# EAGLE schematic Golf Cart Schematic (EAGLE 7.7.0)
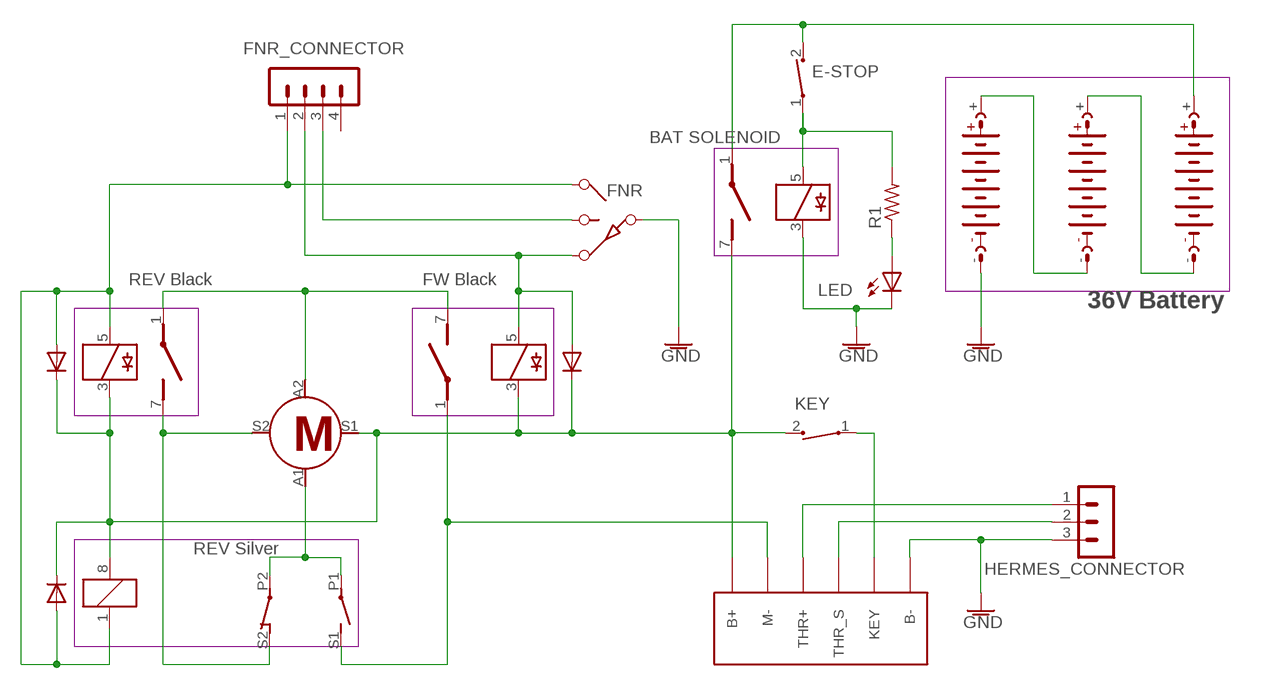
[diagram p0: schematic, sheet 1]

## Parts
D1  1N4933  [DO41-10]
D2  1N4933  [DO41-10]
D3  1N4933  [DO41-10]
E-STOP  CT10-XXXX-G1  [CT10-XXXX-G1]
FNR_CONNECTOR  MA04-1  [MA04-1]
G1  AB9V  [AB9V]
G2  AB9V  [AB9V]
G3  AB9V  [AB9V]
HERMES_CONNECTOR  MA03-1  [MA03-1]
K1  BAT SOLENOID  35701331  [REED]
K2  REV Silver  G6C-2117P  [G6C-2117P]
K4  REV Black  35701331  [REED]
K5  FW Black  35701331  [REED]
KEY  CT10-XXXX-G1  [CT10-XXXX-G1]
LED  LED_E  [LED_1206]
R1  R-US_0204/7  [0204/7]
U$1  MOTOR_PH  [MOTOR_PH]
U$2  THROTTLE_CTRL  [THROTTLE_CTRL]
U$3  FNR  [FNR]

## Nets
GNDA: G2.- HERMES_CONNECTOR.3 K1.3 LED.C U$2.P$2(B-) U$3.P$4(C) ; supply symbol labelled GND
N$1: K4.1(2:P) K5.7(2:S) U$1.A2
N$2: K2.P1(2:P) K2.P2(3:P) U$1.A1
N$3: K2.S2(3:O) K4.7(2:S) U$1.S2
N$4: K2.S1(2:S) K5.1(2:P) U$2.P$4(M-)
N$5: D1.C D2.C D3.C K1.7(2:S) K2.8 K4.3 K5.3 KEY.2 U$1.S1 U$2.P$1(B+)
N$6: D1.A D2.A FNR_CONNECTOR.1 K2.1 K4.5 U$3.P$1
N$8: G1.+ G3.-
N$9: D3.A FNR_CONNECTOR.2 K5.5 U$3.P$3
N$11: E-STOP.2 G3.+ K1.1(2:P)
N$12: E-STOP.1 K1.5 R1.2
N$13: LED.A R1.1
N$14: KEY.1 U$2.P$3(KEY)
N$15: HERMES_CONNECTOR.1 U$2.P$5(THR+)
N$16: HERMES_CONNECTOR.2 U$2.P$6(THR_S)
N$18: G1.- G2.+
N$19: FNR_CONNECTOR.3 U$3.P$2
Unconnected: FNR_CONNECTOR.4

## Notes on the sheet
- 36V Battery

## Library data of the parts
D1-D3 = diode:1N4933: DIODE fast recovery rectifier, 1A
E-STOP KEY = switch-coto:CT10-XXXX-: CT10 Series Molded Switch Source: www.cotorelay.com .. Coto_Technology__CT10-1530-G1.pdf
FNR_CONNECTOR = con-lstb:MA04-1: PIN HEADER; OC_FARNELL: unknown; OC_NEWARK: unknown
G1-G3 = battery:AB9V: 9-V BATTERY CLIP
HERMES_CONNECTOR = con-lstb:MA03-1: PIN HEADER; OC_FARNELL: unknown; OC_NEWARK: unknown
K1 K4 K5 = relay:35701331: RELAY reed, 1 x norm. open with polarity; OC_FARNELL: unknown; OC_NEWARK: unknown
K2 = relay:G6C-2117P: RELAY 1 x norm. open, 1x norm. closed, 10 A/240 V, Omron; OC_FARNELL: unknown; OC_NEWARK: unknown
LED = eagle-ltspice:LED_E: LED Source: http://www.osram.convergy.de Source: www.luxeon.com Source: www.kingbright.com; SPICEMODEL: NONE; SPICEPREFIX: D; SPICETYPE: diode
R1 = rcl:R-US_: RESISTOR, American symbol
U$1 = CPRC:MOTOR_PH
U$2 = CPRC:THROTTLE_CTRL
U$3 = CPRC:FNR